# Altium schematic sheet LED-DRIVER.SchDoc
size A3
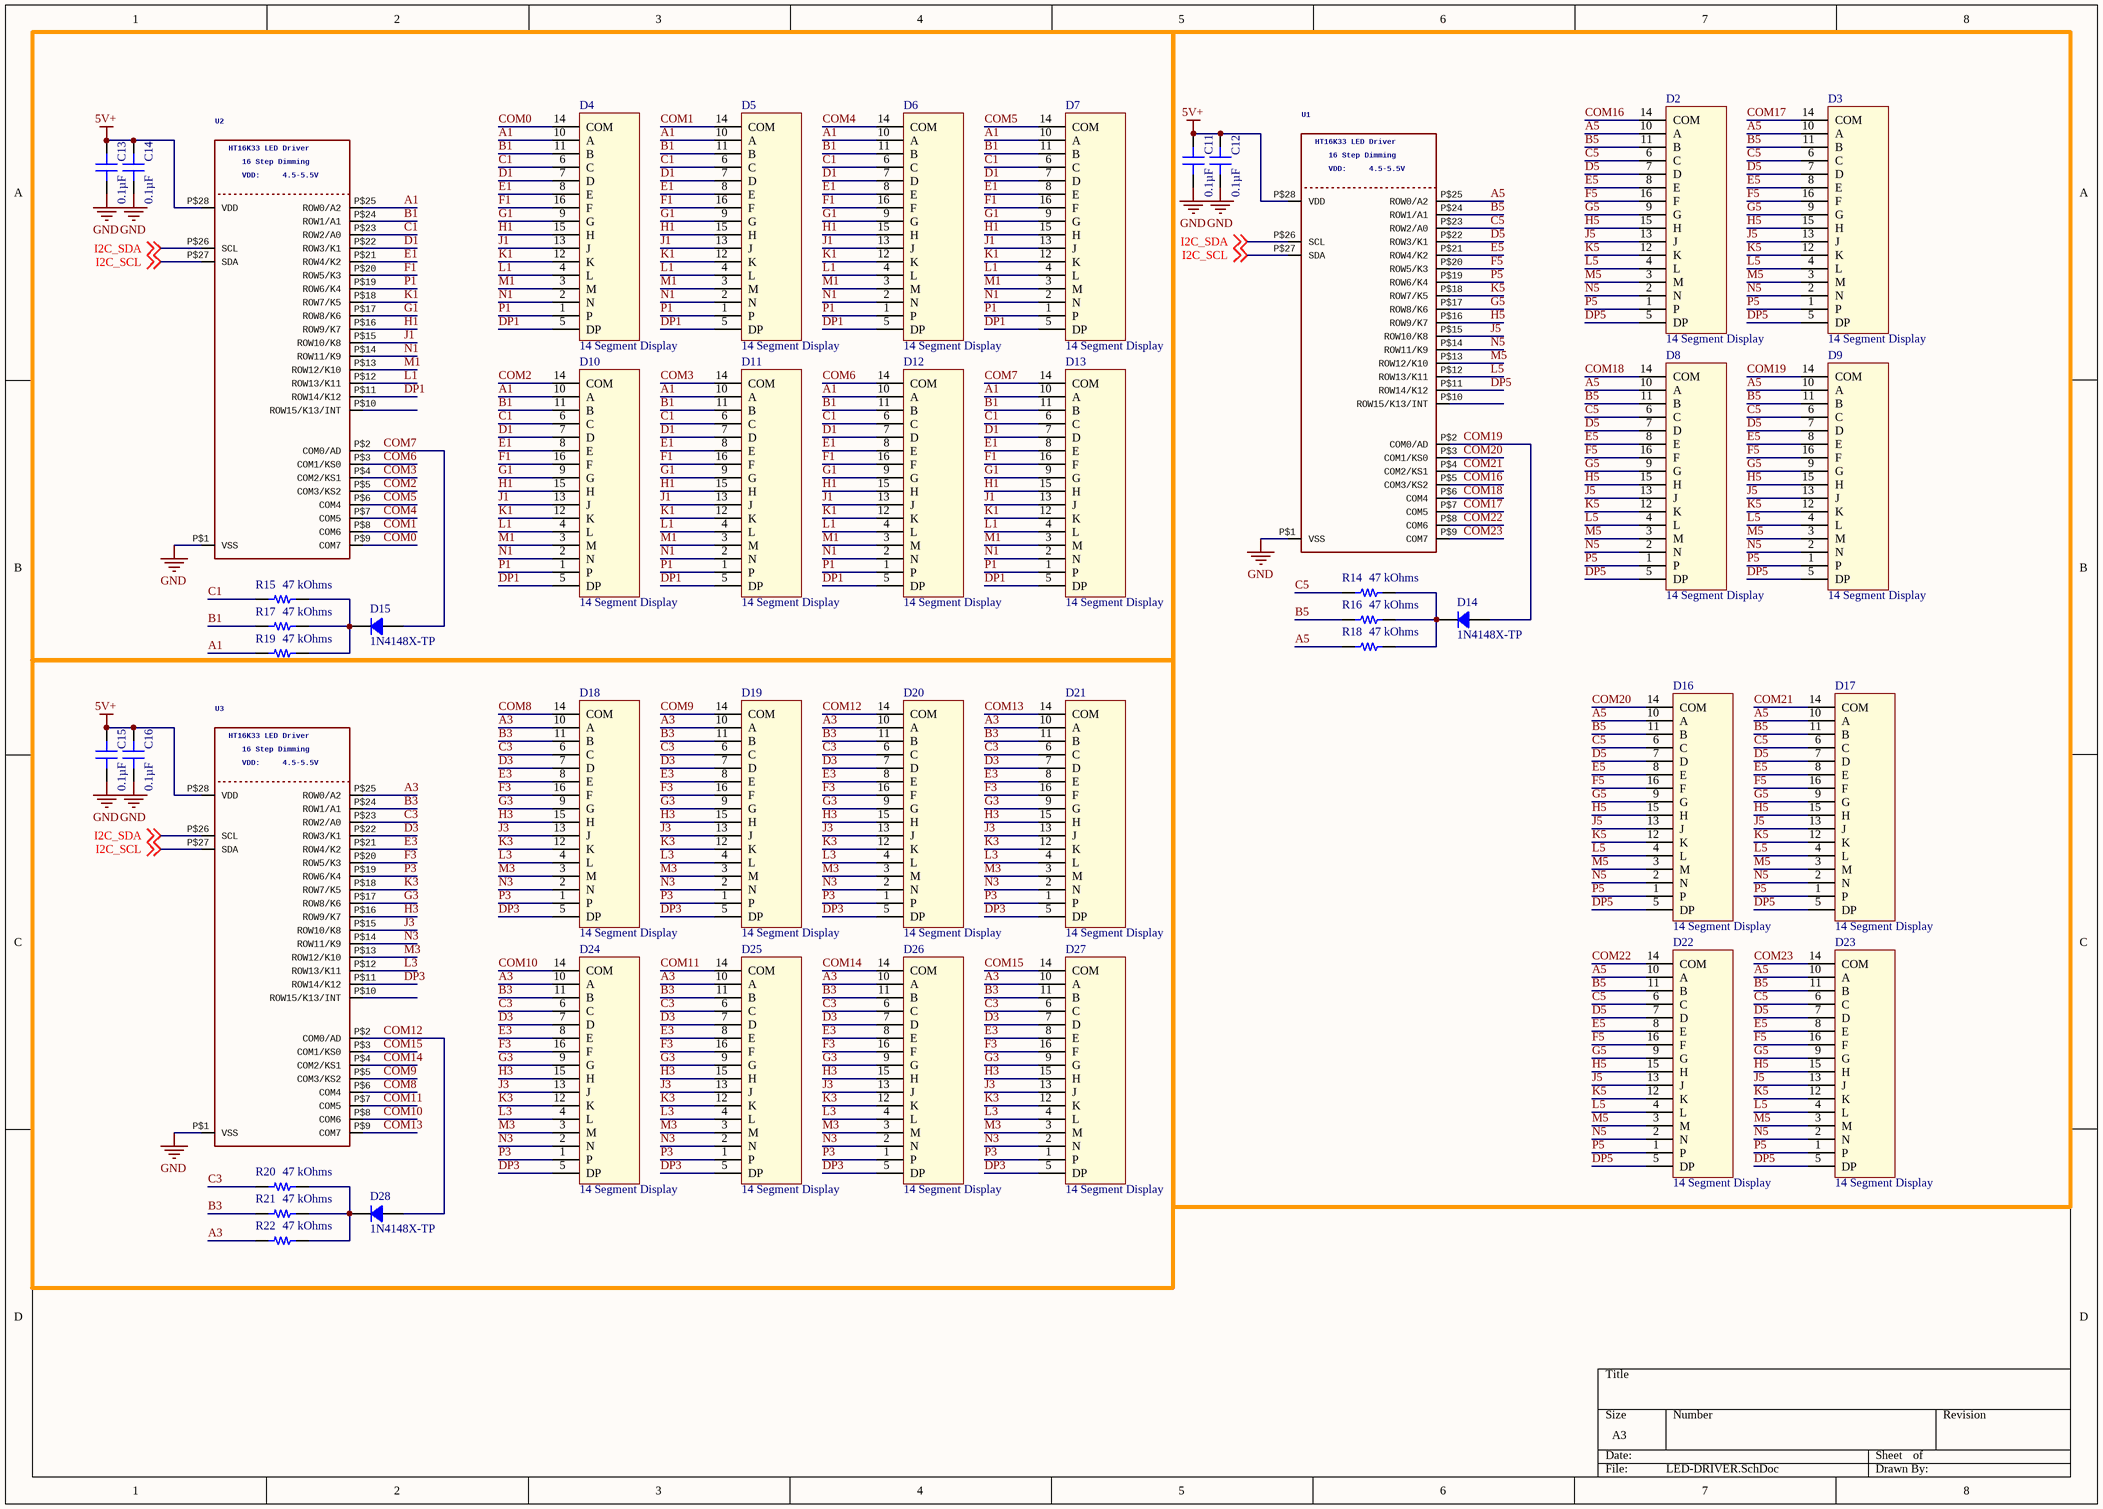
[diagram p0: LED-DRIVER.SchDoc]

## Parts
C11  0.1µF  [CAP 0603_1608]
C12  0.1µF  [CAP 0603_1608]
C13  0.1µF  [CAP 0603_1608]
C14  0.1µF  [CAP 0603_1608]
C15  0.1µF  [CAP 0603_1608]
C16  0.1µF  [CAP 0603_1608]
D2  14 Segment Display  [14 Seg Display]
D3  14 Segment Display  [14 Seg Display]
D4  14 Segment Display  [14 Seg Display]
D5  14 Segment Display  [14 Seg Display]
D6  14 Segment Display  [14 Seg Display]
D7  14 Segment Display  [14 Seg Display]
D8  14 Segment Display  [14 Seg Display]
D9  14 Segment Display  [14 Seg Display]
D10  14 Segment Display  [14 Seg Display]
D11  14 Segment Display  [14 Seg Display]
D12  14 Segment Display  [14 Seg Display]
D13  14 Segment Display  [14 Seg Display]
D14  1N4148X-TP  [SOD-523]
D15  1N4148X-TP  [SOD-523]
D16  14 Segment Display  [14 Seg Display]
D17  14 Segment Display  [14 Seg Display]
D18  14 Segment Display  [14 Seg Display]
D19  14 Segment Display  [14 Seg Display]
D20  14 Segment Display  [14 Seg Display]
D21  14 Segment Display  [14 Seg Display]
D22  14 Segment Display  [14 Seg Display]
D23  14 Segment Display  [14 Seg Display]
D24  14 Segment Display  [14 Seg Display]
D25  14 Segment Display  [14 Seg Display]
D26  14 Segment Display  [14 Seg Display]
D27  14 Segment Display  [14 Seg Display]
D28  1N4148X-TP  [SOD-523]
R14  47 kOhms  [RES 0603_1608]
R15  47 kOhms  [RES 0603_1608]
R16  47 kOhms  [RES 0603_1608]
R17  47 kOhms  [RES 0603_1608]
R18  47 kOhms  [RES 0603_1608]
R19  47 kOhms  [RES 0603_1608]
R20  47 kOhms  [RES 0603_1608]
R21  47 kOhms  [RES 0603_1608]
R22  47 kOhms  [RES 0603_1608]
U1  HT16K33LEDDriver: HT16K33 LED Driver  VDD: VDD:  16StepDimming: 16 Step Dimming  [SOP28_300MIL_SKINNY]  (hidden comment: HT16K33_SOP28_SKINNY)
U2  HT16K33LEDDriver: HT16K33 LED Driver  VDD: VDD:  16StepDimming: 16 Step Dimming  [SOP28_300MIL_SKINNY]  (hidden comment: HT16K33_SOP28_SKINNY)
U3  HT16K33LEDDriver: HT16K33 LED Driver  VDD: VDD:  16StepDimming: 16 Step Dimming  [SOP28_300MIL_SKINNY]  (hidden comment: HT16K33_SOP28_SKINNY)

## Nets
5V+: C11.2 C12.2 C13.2 C14.2 C15.2 C16.2 U1.P$28(VDD) U2.P$28(VDD) U3.P$28(VDD)
GND: C11.1 C12.1 C13.1 C14.1 C15.1 C16.1 U1.P$1(VSS) U2.P$1(VSS) U3.P$1(VSS)
A1: D4.10(A) D5.10(A) D6.10(A) D7.10(A) D10.10(A) D11.10(A) D12.10(A) D13.10(A) R19.1 U2.P$25(ROW0/A2)
A3: D18.10(A) D19.10(A) D20.10(A) D21.10(A) D24.10(A) D25.10(A) D26.10(A) D27.10(A) R22.1 U3.P$25(ROW0/A2)
A5: D2.10(A) D3.10(A) D8.10(A) D9.10(A) D16.10(A) D17.10(A) D22.10(A) D23.10(A) R18.1 U1.P$25(ROW0/A2)
B1: D4.11(B) D5.11(B) D6.11(B) D7.11(B) D10.11(B) D11.11(B) D12.11(B) D13.11(B) R17.1 U2.P$24(ROW1/A1)
B3: D18.11(B) D19.11(B) D20.11(B) D21.11(B) D24.11(B) D25.11(B) D26.11(B) D27.11(B) R21.1 U3.P$24(ROW1/A1)
B5: D2.11(B) D3.11(B) D8.11(B) D9.11(B) D16.11(B) D17.11(B) D22.11(B) D23.11(B) R16.1 U1.P$24(ROW1/A1)
C1: D4.6(C) D5.6(C) D6.6(C) D7.6(C) D10.6(C) D11.6(C) D12.6(C) D13.6(C) R15.1 U2.P$23(ROW2/A0)
C3: D18.6(C) D19.6(C) D20.6(C) D21.6(C) D24.6(C) D25.6(C) D26.6(C) D27.6(C) R20.1 U3.P$23(ROW2/A0)
C5: D2.6(C) D3.6(C) D8.6(C) D9.6(C) D16.6(C) D17.6(C) D22.6(C) D23.6(C) R14.1 U1.P$23(ROW2/A0)
COM0: D4.14(COM) U2.P$9(COM7)
COM1: D5.14(COM) U2.P$8(COM6)
COM2: D10.14(COM) U2.P$5(COM3/KS2)
COM3: D11.14(COM) U2.P$4(COM2/KS1)
COM4: D6.14(COM) U2.P$7(COM5)
COM5: D7.14(COM) U2.P$6(COM4)
COM6: D12.14(COM) U2.P$3(COM1/KS0)
COM7: D13.14(COM) D15.1 U2.P$2(COM0/AD)
COM8: D18.14(COM) U3.P$6(COM4)
COM9: D19.14(COM) U3.P$5(COM3/KS2)
COM10: D24.14(COM) U3.P$8(COM6)
COM11: D25.14(COM) U3.P$7(COM5)
COM12: D20.14(COM) D28.1 U3.P$2(COM0/AD)
COM13: D21.14(COM) U3.P$9(COM7)
COM14: D26.14(COM) U3.P$4(COM2/KS1)
COM15: D27.14(COM) U3.P$3(COM1/KS0)
COM16: D2.14(COM) U1.P$5(COM3/KS2)
COM17: D3.14(COM) U1.P$7(COM5)
COM18: D8.14(COM) U1.P$6(COM4)
COM19: D9.14(COM) D14.1 U1.P$2(COM0/AD)
COM20: D16.14(COM) U1.P$3(COM1/KS0)
COM21: D17.14(COM) U1.P$4(COM2/KS1)
COM22: D22.14(COM) U1.P$8(COM6)
COM23: D23.14(COM) U1.P$9(COM7)
D1: D4.7(D) D5.7(D) D6.7(D) D7.7(D) D10.7(D) D11.7(D) D12.7(D) D13.7(D) U2.P$22(ROW3/K1)
D3: D18.7(D) D19.7(D) D20.7(D) D21.7(D) D24.7(D) D25.7(D) D26.7(D) D27.7(D) U3.P$22(ROW3/K1)
D5: D2.7(D) D3.7(D) D8.7(D) D9.7(D) D16.7(D) D17.7(D) D22.7(D) D23.7(D) U1.P$22(ROW3/K1)
DP1: D4.5(DP) D5.5(DP) D6.5(DP) D7.5(DP) D10.5(DP) D11.5(DP) D12.5(DP) D13.5(DP) U2.P$11(ROW14/K12)
DP3: D18.5(DP) D19.5(DP) D20.5(DP) D21.5(DP) D24.5(DP) D25.5(DP) D26.5(DP) D27.5(DP) U3.P$11(ROW14/K12)
DP5: D2.5(DP) D3.5(DP) D8.5(DP) D9.5(DP) D16.5(DP) D17.5(DP) D22.5(DP) D23.5(DP) U1.P$11(ROW14/K12)
E1: D4.8(E) D5.8(E) D6.8(E) D7.8(E) D10.8(E) D11.8(E) D12.8(E) D13.8(E) U2.P$21(ROW4/K2)
E3: D18.8(E) D19.8(E) D20.8(E) D21.8(E) D24.8(E) D25.8(E) D26.8(E) D27.8(E) U3.P$21(ROW4/K2)
E5: D2.8(E) D3.8(E) D8.8(E) D9.8(E) D16.8(E) D17.8(E) D22.8(E) D23.8(E) U1.P$21(ROW4/K2)
F1: D4.16(F) D5.16(F) D6.16(F) D7.16(F) D10.16(F) D11.16(F) D12.16(F) D13.16(F) U2.P$20(ROW5/K3)
F3: D18.16(F) D19.16(F) D20.16(F) D21.16(F) D24.16(F) D25.16(F) D26.16(F) D27.16(F) U3.P$20(ROW5/K3)
F5: D2.16(F) D3.16(F) D8.16(F) D9.16(F) D16.16(F) D17.16(F) D22.16(F) D23.16(F) U1.P$20(ROW5/K3)
G1: D4.9(G) D5.9(G) D6.9(G) D7.9(G) D10.9(G) D11.9(G) D12.9(G) D13.9(G) U2.P$17(ROW8/K6)
G3: D18.9(G) D19.9(G) D20.9(G) D21.9(G) D24.9(G) D25.9(G) D26.9(G) D27.9(G) U3.P$17(ROW8/K6)
G5: D2.9(G) D3.9(G) D8.9(G) D9.9(G) D16.9(G) D17.9(G) D22.9(G) D23.9(G) U1.P$17(ROW8/K6)
H1: D4.15(H) D5.15(H) D6.15(H) D7.15(H) D10.15(H) D11.15(H) D12.15(H) D13.15(H) U2.P$16(ROW9/K7)
H3: D18.15(H) D19.15(H) D20.15(H) D21.15(H) D24.15(H) D25.15(H) D26.15(H) D27.15(H) U3.P$16(ROW9/K7)
H5: D2.15(H) D3.15(H) D8.15(H) D9.15(H) D16.15(H) D17.15(H) D22.15(H) D23.15(H) U1.P$16(ROW9/K7)
I2C_SCL: U1.P$27(SDA) U2.P$27(SDA) U3.P$27(SDA) ; off-sheet I2C_SCL
I2C_SDA: U1.P$26(SCL) U2.P$26(SCL) U3.P$26(SCL) ; off-sheet I2C_SDA
J1: D4.13(J) D5.13(J) D6.13(J) D7.13(J) D10.13(J) D11.13(J) D12.13(J) D13.13(J) U2.P$15(ROW10/K8)
J3: D18.13(J) D19.13(J) D20.13(J) D21.13(J) D24.13(J) D25.13(J) D26.13(J) D27.13(J) U3.P$15(ROW10/K8)
J5: D2.13(J) D3.13(J) D8.13(J) D9.13(J) D16.13(J) D17.13(J) D22.13(J) D23.13(J) U1.P$15(ROW10/K8)
K1: D4.12(K) D5.12(K) D6.12(K) D7.12(K) D10.12(K) D11.12(K) D12.12(K) D13.12(K) U2.P$18(ROW7/K5)
K3: D18.12(K) D19.12(K) D20.12(K) D21.12(K) D24.12(K) D25.12(K) D26.12(K) D27.12(K) U3.P$18(ROW7/K5)
K5: D2.12(K) D3.12(K) D8.12(K) D9.12(K) D16.12(K) D17.12(K) D22.12(K) D23.12(K) U1.P$18(ROW7/K5)
L1: D4.4(L) D5.4(L) D6.4(L) D7.4(L) D10.4(L) D11.4(L) D12.4(L) D13.4(L) U2.P$12(ROW13/K11)
L3: D18.4(L) D19.4(L) D20.4(L) D21.4(L) D24.4(L) D25.4(L) D26.4(L) D27.4(L) U3.P$12(ROW13/K11)
L5: D2.4(L) D3.4(L) D8.4(L) D9.4(L) D16.4(L) D17.4(L) D22.4(L) D23.4(L) U1.P$12(ROW13/K11)
M1: D4.3(M) D5.3(M) D6.3(M) D7.3(M) D10.3(M) D11.3(M) D12.3(M) D13.3(M) U2.P$13(ROW12/K10)
M3: D18.3(M) D19.3(M) D20.3(M) D21.3(M) D24.3(M) D25.3(M) D26.3(M) D27.3(M) U3.P$13(ROW12/K10)
M5: D2.3(M) D3.3(M) D8.3(M) D9.3(M) D16.3(M) D17.3(M) D22.3(M) D23.3(M) U1.P$13(ROW12/K10)
N1: D4.2(N) D5.2(N) D6.2(N) D7.2(N) D10.2(N) D11.2(N) D12.2(N) D13.2(N) U2.P$14(ROW11/K9)
N3: D18.2(N) D19.2(N) D20.2(N) D21.2(N) D24.2(N) D25.2(N) D26.2(N) D27.2(N) U3.P$14(ROW11/K9)
N5: D2.2(N) D3.2(N) D8.2(N) D9.2(N) D16.2(N) D17.2(N) D22.2(N) D23.2(N) U1.P$14(ROW11/K9)
P1: D4.1(P) D5.1(P) D6.1(P) D7.1(P) D10.1(P) D11.1(P) D12.1(P) D13.1(P) U2.P$19(ROW6/K4)
P3: D18.1(P) D19.1(P) D20.1(P) D21.1(P) D24.1(P) D25.1(P) D26.1(P) D27.1(P) U3.P$19(ROW6/K4)
P5: D2.1(P) D3.1(P) D8.1(P) D9.1(P) D16.1(P) D17.1(P) D22.1(P) D23.1(P) U1.P$19(ROW6/K4)
NetD14_2: D14.2 R14.2 R16.2 R18.2
NetD15_2: D15.2 R15.2 R17.2 R19.2
NetD28_2: D28.2 R20.2 R21.2 R22.2

Not connected (* = marked no-connect by the designer): U1 P$10(ROW15/K13/INT); U2 P$10(ROW15/K13/INT); U3 P$10(ROW15/K13/INT)

## Library data of the parts
C11-C16 = C0603T104K3RAL7867: CAP CER 0.1UF 25V X7R 0603; Manufacturer: KEMET; Ratings: COTS; Tolerance: ±10%; Part Number: C0603T104K3RAL7867; Value: 0.1µF; Applications: High Reliability, Bypass, Decoupling; Capacitance: 0.1µF; ComponentLink1Description: Datasheet; ComponentLink1URL: https://api.kemet.com/component-edge/download/datasheet/C0603T104K3RAL7867.pdf; ComponentLink2Description: DigiKey Link; ComponentLink2URL: http://digikey.com/product-detail/en/kemet/C0603T104K3RAL7867/399-14540-1-ND/7103832; Device Package: 0603 (1608 Metric); LastUpdated: 21/01/2020 00:02:09; Lifecycle Status: Active; Minimum Order: 1; Mounting Type: Surface Mount, MLCC; Operating Temperature: -55°C ~ 125°C; Package / Case: 0603 (1608 Metric); Packaging: TapeAndReel; PartId: 2525; Part Status: Active; Price: 0.23; Series: SMD COTS X7R; Size / Dimension: 0.063" L x 0.031" W (1.60mm x 0.80mm); Supplier 1: DigiKey; Supplier Part Number 1: 399-14540-1-ND; Temperature Coefficient: X7R; Thickness (Max): 0.034" (0.87mm); Voltage - Rated: 25V
D2-D13 D16-D27 = 14 Segment Display: 14 Segment display red 2 char
D14 D15 D28 = 1N4148X-TP: DIODE GEN PURP 75V 150MA SOD523; Manufacturer: Micro Commercial Co; Capacitance @ Vr, F: 2pF @ 0V, 1MHz; Current - Reverse Leakage @ Vr: 1µA @ 75V; Diode Type: Standard; Reverse Recovery Time (trr): 4ns; Speed: Small Signal =< 200mA (Io), Any Speed; Voltage - Forward (Vf) (Max) @ If: 1.25V @ 150mA; Part Number: 1N4148X-TP; ComponentLink1Description: Datasheet; ComponentLink1URL: https://www.mccsemi.com/pdf/Products/1N4148X(SOD-523).PDF; ComponentLink2Description: DigiKey Link; ComponentLink2URL: http://digikey.com/product-detail/en/micro-commercial-co/1N4148X-TP/1N4148XTPMSCT-ND/789335; Current - Average Rectified (Io): 150mA; Device Package: SC-79, SOD-523; LastUpdated: 21/01/2020 03:36:43; Lifecycle Status: Active; Minimum Order: 1; Mounting Type: Surface Mount; Operating Temperature - Junction: -65°C ~ 150°C; Package / Case: SC-79, SOD-523; Packaging: TapeAndReel; PartId: 2733; Part Status: Active; Price: 0.02; Series: -; Supplier 1: DigiKey; Supplier Part Number 1: 1N4148XTPMSCT-ND; Supplier Device Package: SOD-523; Voltage - DC Reverse (Vr) (Max): 75V
R14-R22 = ERA-3AEB473V: RES SMD 47K OHM 0.1% 1/10W 0603; Manufacturer: Panasonic Electronic Components; Power (Watts): 0.1W, 1/10W; Temperature Coefficient: ±25ppm/°C; Part Number: ERA-3AEB473V; Value: 47 kOhms; ComponentLink1Description: Datasheet; ComponentLink1URL: https://industrial.panasonic.com/cdbs/www-data/pdf/RDM0000/AOA0000C307.pdf; ComponentLink2Description: DigiKey Link; ComponentLink2URL: http://digikey.com/product-detail/en/panasonic-electronic-components/ERA-3AEB473V/P47KDBCT-ND/1466092; Composition: Thin Film; Device Package: 0603 (1608 Metric); Features: Automotive AEC-Q200; Height - Seated (Max): 0.022" (0.55mm); LastUpdated: 21/01/2020 00:24:44; Lifecycle Status: Active; Minimum Order: 1; Number of Terminations: 2; Operating Temperature: -55°C ~ 155°C; Package / Case: 0603 (1608 Metric); Packaging: TapeAndReel; PartId: 5512; Part Status: Active; Price: 0.04; Ratings: AEC-Q200; Resistance: 47 kOhms; Series: ERA-3A; Size / Dimension: 0.063" L x 0.031" W (1.60mm x 0.80mm); Supplier 1: DigiKey; Supplier Part Number 1: P47KDBCT-ND; Supplier Device Package: 0603; Tolerance: ±0.1%
U1-U3 = HT16K33_SOP28_SKINNY: GateName_1: G$1; SymbolName_1: HT16K33_28PIN; DeviceName: _SKINNY; LibraryName: microbuilder; DeviceSetName: HT16K33_SOP28; 4.5-5.5V: 4.5-5.5V